# EAGLE design mounted temp sensor breakout board V1 (EAGLE 7.6.0)
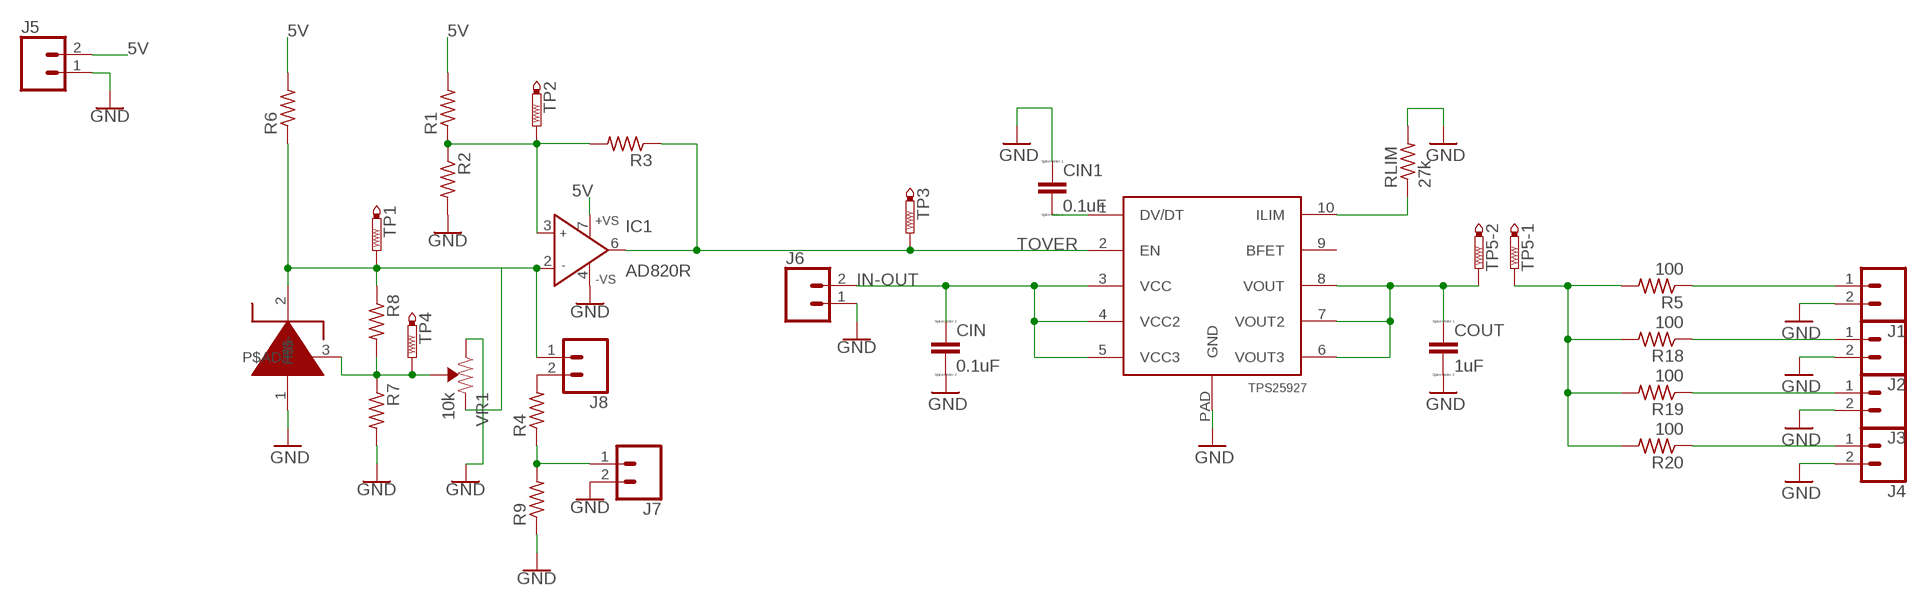
[diagram p0: schematic, sheet 1]

## Parts
CIN  0.1uF  C  [C0805]
CIN1  0.1uF  C  [C0805]
COUT  1uF  C  [C0805]
IC1  AD820R  [SO8]
J1  CONN_02PTH4  [1X02_XTRA_BIG]
J2  CONN_02PTH4  [1X02_XTRA_BIG]
J3  CONN_02PTH4  [1X02_XTRA_BIG]
J4  CONN_02PTH4  [1X02_XTRA_BIG]
J5  CONN_02PTH4  [1X02_XTRA_BIG]
J6  CONN_02PTH4  [1X02_XTRA_BIG]
J7  CONN_02PTH3  [1X02_LONGPADS]
J8  CONN_02  [1X02]
R1  R-US_R0805  [R0805]
R2  R-US_R0805  [R0805]
R3  R-US_R0805  [R0805]
R4  R-US_R0805  [R0805]
R5  100  R-US_R0805  [R0805]
R6  R-US_R0805  [R0805]
R7  R-US_R0805  [R0805]
R8  R-US_R0805  [R0805]
R9  R-US_R0805  [R0805]
R18  100  R-US_R0805  [R0805]
R19  100  R-US_R0805  [R0805]
R20  100  R-US_R0805  [R0805]
RLIM  27k  R-US_R0805  [R0805]
TP1  PTR1PAD1-13Y  [P1-13Y]
TP2  PTR1PAD1-13Y  [P1-13Y]
TP3  PTR1PAD1-13Y  [P1-13Y]
TP4  PTR1PAD1-13Y  [P1-13Y]
TP5  PTR2  [P2-38-17]
U$1  LM135Z  [TO-92-3]
U$5  TPS252927  [VSON10]
VR1  10k  TRIMPOT-SMD-3MM-OPEN-1/10W-25%  [TRIMPOT-SMD-TC33X]

## Nets
5V: IC1.7(+VS) J5.2 R1.2 R6.2
GND: CIN1.1 CIN.2 COUT.2 IC1.4(-VS) J1.2 J2.2 J3.2 J4.2 J5.1 J6.1 J7.2 R2.2 R7.2 R9.1 RLIM.2 U$1.1(P$-) U$5.PAD(GND) VR1.1(CW)
HEATER1: J3.1 R19.1
IN-OUT: CIN.1 J6.2 U$5.3(VCC) U$5.4(VCC2) U$5.5(VCC3)
N$1: J1.1 R5.1
N$2: IC1.3(IN+) R1.1 R2.1 R3.2 TP2.TP
N$3: IC1.2(IN-) J8.1 R6.1 R8.1 TP1.TP U$1.2(P$+) VR1.3(CCW)
N$4: R7.1 R8.2 TP4.TP U$1.3(P$ADJ) VR1.2(WIPER)
N$5: J2.1 R18.1
N$6: J4.1 R20.1
N$7: J7.1 R4.1 R9.2
N$8: CIN1.2 U$5.1(DV/DT)
N$9: R5.2 R18.2 R19.2 R20.2 TP5.TP-1
N$10: RLIM.1 U$5.10(ILIM)
N$11: J8.2 R4.2
N$15: COUT.1 TP5.TP-2 U$5.6(VOUT3) U$5.7(VOUT2) U$5.8(VOUT)
TOVER: IC1.6(OUT) R3.1 TP3.TP U$5.2(EN)
Unconnected: U$5.9(BFET)

## Library data of the parts
CIN CIN1 COUT = eagle-ltspice:C: CAPACITOR, European symbol; SPICEMODEL: NONE; SPICEPREFIX: C
IC1 = analog-devices:AD820: Single-Supply, Rail-to-Rail, Low Power, FET Input Op Amp Source: http://www.analog.com/static/imported-files/data_sheets/AD820.pdf; OC_FARNELL: 1838867; OC_NEWARK: unknown
J1-J8 = SparkFun-Connectors:CONN_02: Multi connection point. Often used as Generic Header-pin footprint for 0.1 inch spaced/style header connections On any of the 0.1 inch spaced packages, you can populate with these: Break Away Headers - Straight <https://www.sparkfun.com/products/116> (PRT-00116) Break Away Male Headers - Right Angle <https://www.sparkfun.com/products/553> (PRT-00553) Female Headers <https://www.sparkfun.com/products/115> (PRT-00115) Break Away Headers - Machine Pin <https://www.sparkfun.com/products/117> (PRT-00117) Break Away Female Headers - Swiss Machine Pin <https://www.sparkfun.com/products/743> (PRT-00743) For SCREWTERMINALS and SPRING TERMINALS visit here: Screw Terimnals on SparkFun.com <https://www.sparkfun.com/search/results?term=Screw+Terminals> (5mm/3.5mm/2.54mm spacing) This device is also useful as a general connection point to wire up your design to another part of your project. Our various solder wires solder well into these plated through hole pads. Hook-Up Wire - Assortment (Stranded, 22 AWG) <https://www.sparkfun.com/products/11375> (PRT-11375) Hook-Up Wire - Assortment (Solid Core, 22 AWG) <https://www.sparkfun.com/products/11367> (PRT-11367) View the entire wire category on our website here <https://www.sparkfun.com/categories/141> Special notes: Molex polarized connector foot print use with: PRT-08233 with associated crimp pins and housings. 2.54_SCREWTERM for use with PRT-10571. 3.5mm Screw Terminal footprints for PRT-08084 5mm Screw Terminal footprints for use with PRT-08432
R1-R9 R18-R20 RLIM = rcl:R-US_: RESISTOR, American symbol
TP1-TP4 = testpad:PTR1: TEST PIN
TP5 = testpad:PTR2: TEST PIN
U$1 = Parts for Power Team1:LM135Z
U$5 = Parts for Power Team1:TPS252927: http://www.ti.com/product/tps25927/datasheet
VR1 = SparkFun-Resistors:TRIMPOT: Trimming Potentiometer (Trimpot) Three-terminal potentiometers, with an adjustable wiper and two adjustable resistors. A pot can be used to create a configurable voltage divider, or as a variable resistor. "Trimpots" are a subset of potentiometers, usually intended for "set-and-forget" applications. They're often more delicate than standard potentiometers - rated for fewer turns. Variants PTH-KNOB - PTH Trimpot w/ finger-adjustable knob Trimpot 10K with Knob <https://www.sparkfun.com/products/9806> (COM-09806) Datasheet <http://www.sparkfun.com/datasheets/Components/General/TSR-3386.pdf> SMD-3MM-CLOSED-FRAME - SMD 3mm Square Closed-Frame Trimpot Used on e.g. EasyDriver - Stepper Motor Driver <https://www.sparkfun.com/products/12779> Datasheet <http://www.bitechnologies.com/pdfs/22.pdf> (22AR10KTR) SMD-5MM - SMD 5mm Square Closed-Frame Trimpot Used on e.g. IOIO-OTG - V2.2 <https://www.sparkfun.com/products/13613> Datasheet <http://www.vishay.com/docs/51008/ts53.pdf> (TS53YL502MR10) SMD-3MM-1/10W-25% - 3mm Square Open-Frame Trimpot Used on e.g. SparkFun Shapeoko <https://www.sparkfun.com/products/13899> Datasheet <http://www.bourns.com/docs/Product-Datasheets/TC33.pdf> (TC33X-2-103E); PROD_ID: RES-12428

## Board
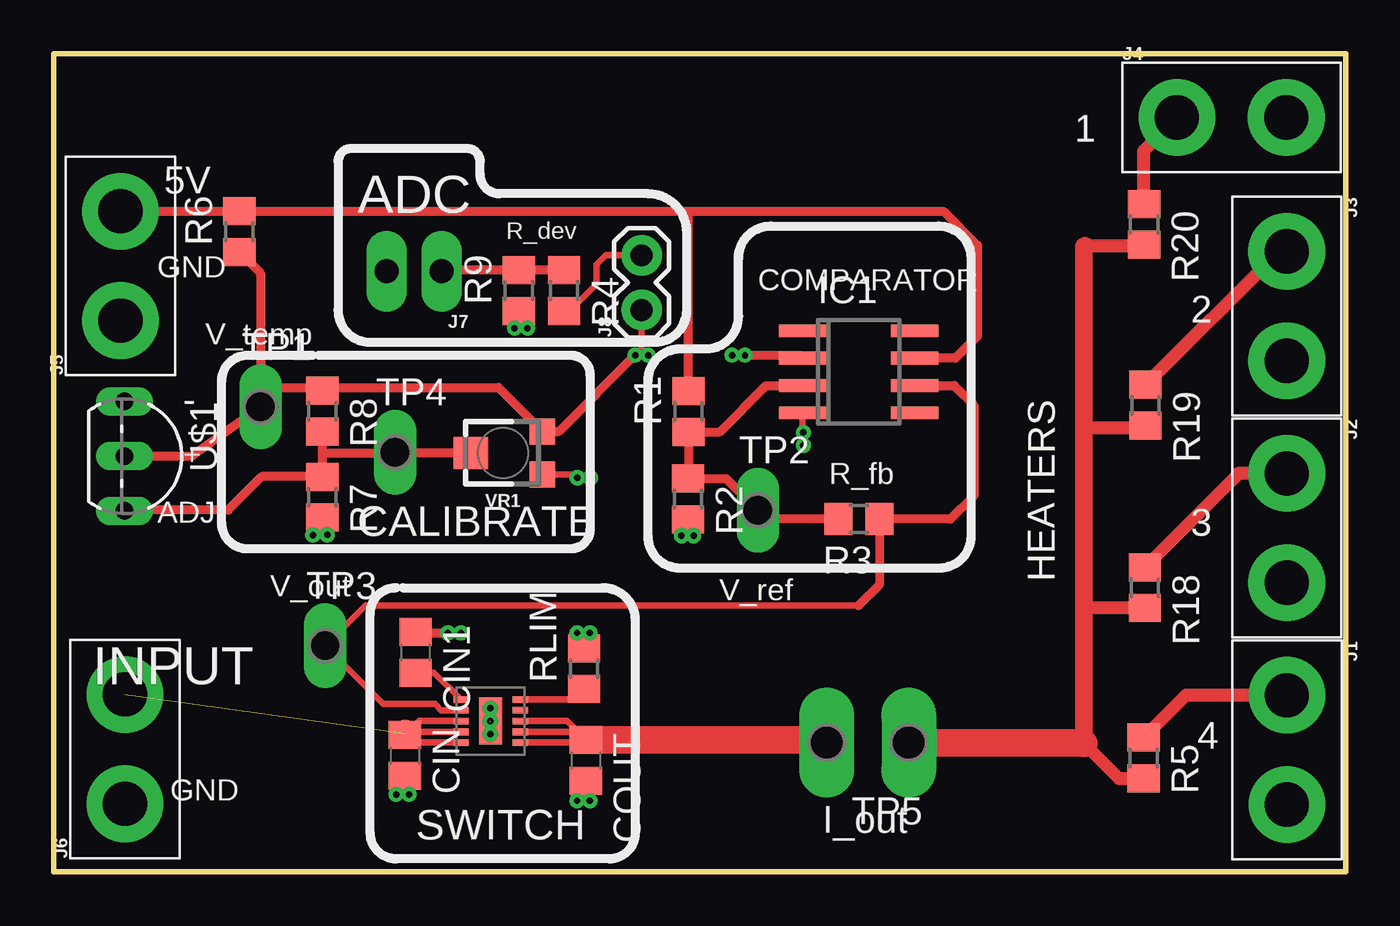
[diagram p1: board, top side]
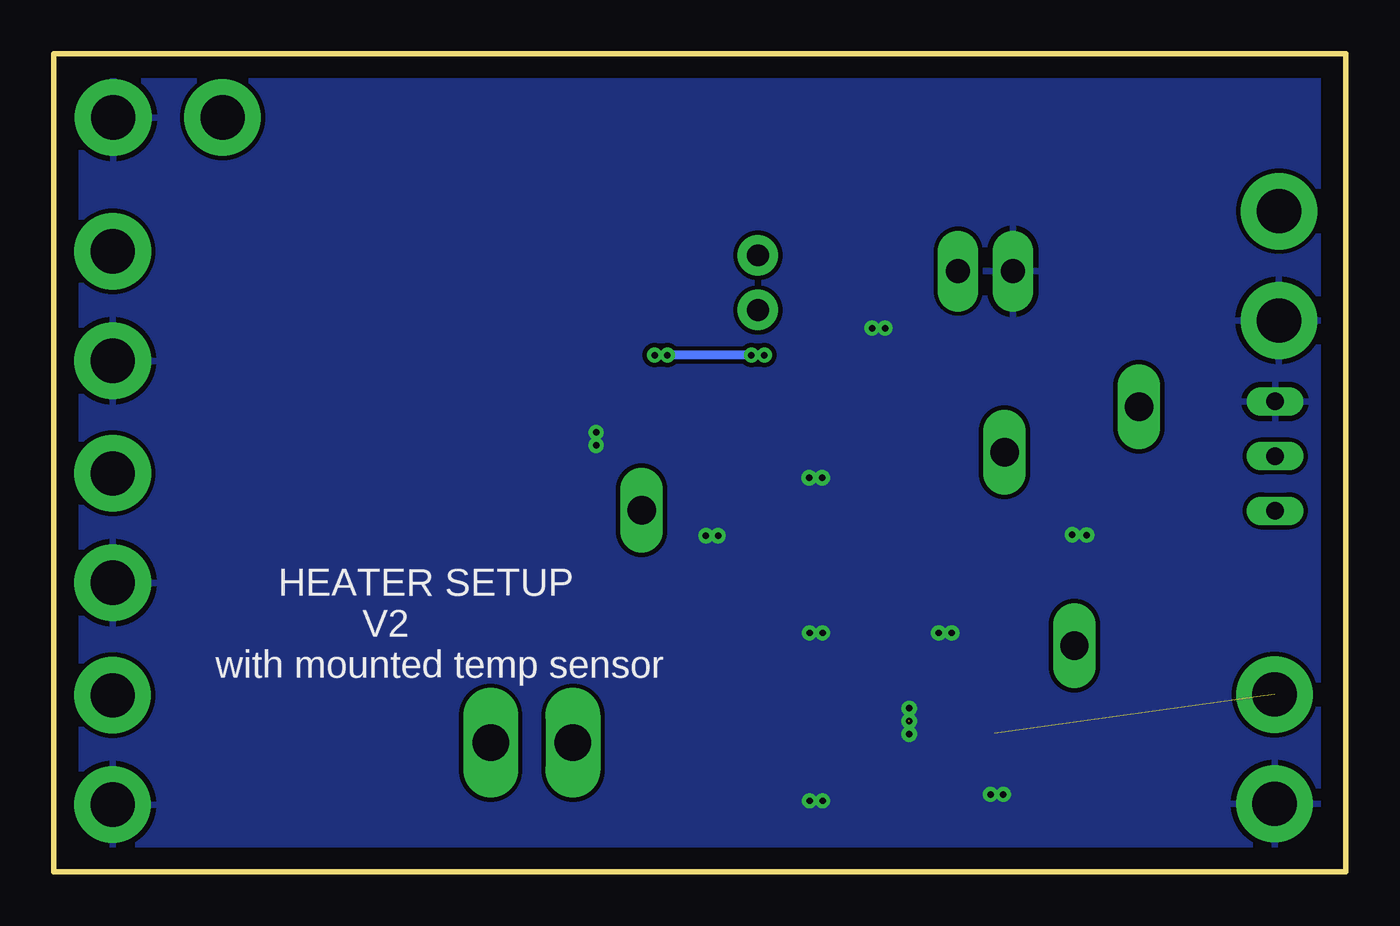
[diagram p2: board, bottom side, seen from below]

Size 60 x 38 mm. Coordinates in mm from the lower left corner, seen from the top.
Outline: 0,0 0,38 60,38 60,0 0,0
Copper layers (1*16): Top 0.035mm / dielectric 1.5mm / Bottom 0.035mm
Design rules "default": minimum track width 10mil, minimum drill 24mil, track to track 8mil, track to pad 8mil, pad to pad 8mil, via to via 8mil, smd to smd 8mil, copper to edge 40mil, drill to drill 8mil, minimum pad ring 10mil, minimum via ring 8mil, stop-mask expansion 4mil, vias tented up to drill 0mil, thermal gap 10mil

### Footprints (pad centres in the part's own frame; a part is rotated, then mirrored left to right if it is on the bottom)
C0805 = smd 1.3 x 1.5: 1 -0.95,0; 2 0.95,0
SO8 = smd 0.6 x 2.2: 1 -1.905,-2.6; 2 -0.635,-2.6; 3 0.635,-2.6; 4 1.905,-2.6; 5 1.905,2.6; 6 0.635,2.6; 7 -0.635,2.6; 8 -1.905,2.6
1X02_XTRA_BIG = drill 2.057 pad 3.556: 1 -2.54,0; 2 2.54,0
1X02_LONGPADS = drill 1.118 pad 1.88 long: 1 0,0; 2 2.54,0
1X02 = drill 1.016 pad 1.88: 1 0,0; 2 2.54,0
R0805 = smd 1.3 x 1.5: 1 -0.95,0; 2 0.95,0
P1-13Y = drill 1.321 pad 1.905 long: TP 0,0
P2-38-17 = drill 1.702 pad 2.121 long: TP-1 -1.905,0; TP-2 1.905,0
TO-92-3 = drill 0.813 long: 1 -2.54,0; 2 0,0; 3 2.54,0
VSON10 = smd 0.7 x 0.305: 1 0.2,2.575; 2 0.2,2.075; 3 0.2,1.575; 4 0.2,1.075; 5 0.2,0.575; 6 2.95,0.575; 7 2.95,1.075; 8 2.95,1.575; 9 2.95,2.075; 10 2.95,2.575 | smd 1.067 x 2.184: PAD 1.575,1.575
TRIMPOT-SMD-TC33X = smd 1.2 x 1.2: 1 -1,-1.825; 3 1,-1.825 | smd 1.5 x 1.6: 2 0,1.5

### Placement (x,y rotation side)
CIN  16.31,5.41 270 top
CIN1  16.8,10.2 270 top
COUT  24.71,5.18 270 top
IC1  37.38,23.23 270 top
J1  57.27,5.66 270 top
J2  57.26,15.97 270 top
J3  57.27,26.28 270 top
J4  54.7,35.04 0 top
J5  3.1,28.15 90 top
J6  3.3,5.7 90 top
J7  18,27.9 180 top
J8  27.3,26.1 90 top
R1  29.48,21.38 90 top
R2  29.46,17.32 270 top
R3  37.39,16.4 180 top
R4  23.7,27 270 top
R5  50.62,5.29 270 top
R6  8.62,29.74 90 top
R7  12.48,17.4 270 top
R8  12.47,21.4 270 top
R9  21.6,27 90 top
R18  50.67,13.2 270 top
R19  50.7,21.68 270 top
R20  50.63,30.08 270 top
RLIM  24.63,9.44 90 top
TP1  9.6,21.6 0 top
TP2  32.7,16.8 0 top
TP3  12.6,10.5 0 top
TP4  15.84,19.49 0 top
TP5  37.8,6 180 top
U$1  3.27,19.31 270 top
U$5  18.71,5.43 0 top
VR1  20.86,19.46 90 top

### Tracks (layer width: path | path; a pad name or v marks a point on that pad's centre or on a via)
5V
  Top 0.406: J5.2 R6.2 29.58,30.69 | 29.58,30.69 41.31,30.69 42.9,29.1 42.9,24.89 41.87,23.86 IC1.7 | R1.2 29.48,30.59 29.58,30.69
GND  (via drill 0.3)  (1 unrouted)
  Top 0.305: VR1.1 24.17,18.46 v24.32,18.31 | IC1.4 34.78,20.45 v34.82,20.41
  Top 0.406: R9.1 21.6,25.46 v21.4,25.26 | CIN1.1 16.85,11.1 v18.3,11.1
  Top 0.61: R7.2 12.7,16.23 v12.7,15.66 | CIN.2 16.5,4.27 v16.5,3.6 | COUT.2 24.3,3.82 v24.3,3.3 | v24.9,3.3 24.59,3.61 24.59,3.99 | v24.9,11.1 24.62,10.82 RLIM.2 | v29.15,15.62 29.46,15.93 R2.2
  other vias: 15.9,3.6 24.3,11.1 12.03,15.64 29.72,15.61 24.92,18.31 22,25.26 34.82,19.81 18.9,11.1 20.27,7 20.27,7.6 20.27,6.4
  pour Bottom: 0,0.3 0,41.1 63.6,41.1 63.6,0 63.6,-0.6 0,-0.6
HEATER1
  Top 0.61: J3.1 56.89,28.82 R19.1
IN-OUT  (1 unrouted)
  Top 0.305: U$5.3 16.96,7 CIN.1 | U$5.4 16.46,6.5 CIN.1 | U$5.5 16.66,6 CIN.1
  Top 1.27: 16.31,6.44 CIN.1
N$1
  Top 0.61: J1.1 52.58,8.2 R5.1
N$2
  Top 0.406: IC1.3 34.77,22.58 33.09,22.58 30.94,20.43 R1.1 29.48,18.29 R2.1 31.23,18.27 TP2.TP 33.1,16.39 R3.2
N$3  (via drill 0.3)
  Top 0.305: J8.1 27.3,24.3 v27,24
  Top 0.406: TP1.TP 9.6,22.5 12.9,22.5 | 12.9,22.5 12.75,22.35 R8.1 | U$1.2 6.41,19.31 TP1.TP | 12.9,22.5 20.65,22.5 VR1.3 23.46,20.46 v27,24 | v31.5,24 v32.1,24 34.64,24 IC1.2 | R6.1 9.6,27.81 TP1.TP
  Bottom 0.406: v27,24 v27.6,24 v31.5,24
N$4
  Top 0.406: R8.2 12.47,19.56 | 12.47,19.56 12.47,18.36 | 12.47,18.36 R7.1 | 12.47,18.36 9.66,18.36 8.1,16.8 3.3,16.8 U$1.3 | VR1.2 19.33,19.49 TP4.TP 15.81,19.46 12.57,19.46 12.47,19.56
N$5
  Top 0.61: J2.1 55.03,18.51 R18.1
N$6
  Top 0.61: R20.1 50.63,33.51 J4.1
N$7
  Top 0.406: R9.2 R4.1 18.05,27.95 J7.1
N$8
  Top 0.305: CIN1.2 17.67,9.25 U$5.1
N$9
  Top 0.61: 47.88,29.09 50.6,29.09 R20.2 | R19.2 50.59,20.73 50.46,20.61 47.95,20.61 47.85,20.71 | R18.2 47.88,12.25 47.85,12.22 | 47.85,5.97 49.48,4.34 R5.2
  Top 0.813: 47.85,5.97 47.85,12.22 47.85,20.71 47.85,29.06 47.88,29.09
  Top 1.27: TP5.TP-1 47.7,6 47.71,6 47.82,6 47.85,5.97
N$10
  Top 0.305: RLIM.1 24.14,8 U$5.10
N$11
  Top 0.305: J8.2 25.64,28.64 25.2,28.2 25.2,27.3 24.3,26.4 24.05,26.4 R4.2
N$15
  Top 0.305: U$5.8 23.84,7 COUT.1 | U$5.7 24.34,6.5 COUT.1 | U$5.6 24.59,6 COUT.1
  Top 1.27: COUT.1 35.77,6.13 TP5.TP-2
TOVER
  Top 0.305: 37.38,12.37 14.47,12.37 TP3.TP 15.3,7.8 17.7,7.8 18,7.5 U$5.2
  Top 0.406: IC1.6 41.82,22.59 42.73,21.68 42.73,17.46 41.64,16.38 38.35,16.38 R3.1 38.34,13.34 37.38,12.37

### Text on the board
tSilk: 1 | 5V | ADC | R_dev | GND | COMPARATOR | V_temp | 2 | - | + | R_fb | ADJ | CALIBRATE | 3 | V_out | HEATERS | V_ref | INPUT | 4 | GND | SWITCH | I_out
_bsilk: HEATER SETUP / V2 / with mounted temp sensor